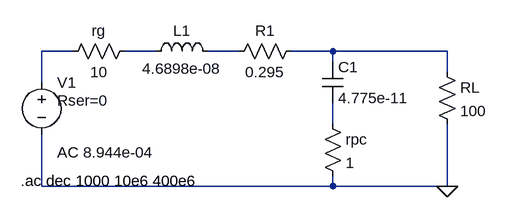
[diagram p0: schematic eje2b.asc]
eje2b.asc, the LTspice schematic file:
Version 4
SHEET 1 880 680
WIRE -496 64 -544 64
WIRE -368 64 -416 64
WIRE -240 64 -288 64
WIRE -96 64 -160 64
WIRE 80 64 -96 64
WIRE -96 80 -96 64
WIRE 80 96 80 64
WIRE -544 112 -544 64
WIRE -96 176 -96 144
WIRE -544 272 -544 192
WIRE -96 272 -96 256
WIRE -96 272 -544 272
WIRE 80 272 80 176
WIRE 80 272 -96 272
FLAG 80 272 0
SYMBOL res -400 48 R90
WINDOW 0 0 56 VBottom 2
WINDOW 3 32 56 VTop 2
SYMATTR InstName rg
SYMATTR Value 10
SYMBOL res 64 80 R0
SYMATTR InstName RL
SYMATTR Value 100
SYMBOL cap -112 80 R0
SYMATTR InstName C1
SYMATTR Value 4.775e-11
SYMBOL ind -384 80 R270
WINDOW 0 32 56 VTop 2
WINDOW 3 5 56 VBottom 2
SYMATTR InstName L1
SYMATTR Value 4.6898e-08
SYMATTR SpiceLine Rser=0
SYMBOL voltage -544 96 R0
WINDOW 123 24 124 Left 2
WINDOW 39 24 44 Left 2
SYMATTR Value2 AC 8.944e-04
SYMATTR SpiceLine Rser=0
SYMATTR InstName V1
SYMATTR Value ""
SYMBOL res -112 160 R0
SYMATTR InstName rpc
SYMATTR Value 1
SYMBOL res -144 48 R90
WINDOW 0 0 56 VBottom 2
WINDOW 3 32 56 VTop 2
SYMATTR InstName R1
SYMATTR Value 0.295
TEXT -576 264 Left 2 !.ac dec 1000 10e6 400e6

The netlist it stands for:
* eje2b.asc
rg N002 N001 10
RL N004 0 100
C1 N004 N005 4.775e-11
L1 N002 N003 4.6898e-08 Rser=0
V1 N001 0 AC 8.944e-04 Rser=0
rpc N005 0 1
R1 N004 N003 0.295
.ac dec 1000 10e6 400e6
.backanno
.end